# EAGLE design LCD and Button Board (EAGLE 8.2.0)
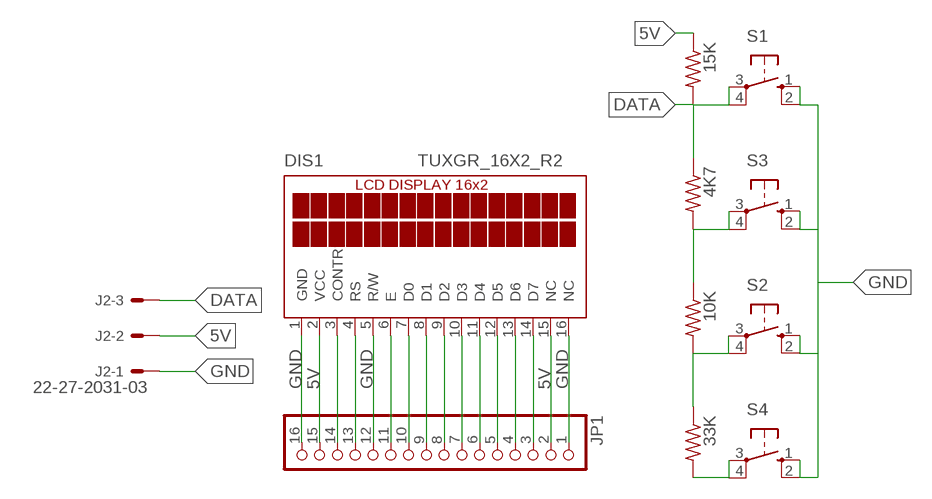
[diagram p0: schematic, sheet 1]

## Parts
4K7  R-US_0207/10  [0207/10]
10K  R-US_0207/10  [0207/10]
15K  R-US_0207/10  [0207/10]
33K  R-US_0207/10  [0207/10]
DIS1  TUXGR_16X2_R2  [TUXGR_16X2_R2]
J2  22-27-2031-03  [6410-03]
JP1  PINHD-1X16  [1X16]
S1  40-XX  [B3F-40XX]
S2  40-XX  [B3F-40XX]
S3  40-XX  [B3F-40XX]
S4  40-XX  [B3F-40XX]

## Nets
5V: 15K.1 DIS1.2(VCC) DIS1.15(NC) J2.2 JP1.2 JP1.15
DATA: 4K7.1 15K.2 J2.3 S1.3(P) S1.4(P1)
GND: DIS1.1(GND) DIS1.5(R/W) DIS1.16(NC) J2.1 JP1.1 JP1.12 JP1.16 S1.1(S) S1.2(S1) S2.1(S) S2.2(S1) S3.1(S) S3.2(S1) S4.1(S) S4.2(S1)
N$3: DIS1.3(CONTR) JP1.14
N$4: DIS1.4(RS) JP1.13
N$6: DIS1.6(E) JP1.11
N$7: DIS1.7(D0) JP1.10
N$8: DIS1.8(D1) JP1.9
N$9: DIS1.9(D2) JP1.8
N$10: DIS1.10(D3) JP1.7
N$11: DIS1.11(D4) JP1.6
N$12: DIS1.12(D5) JP1.5
N$13: DIS1.13(D6) JP1.4
N$14: DIS1.14(D7) JP1.3
N$17: 33K.2 S4.3(P) S4.4(P1)
N$18: 10K.2 33K.1 S2.3(P) S2.4(P1)
N$19: 4K7.2 10K.1 S3.3(P) S3.4(P1)

## Library data of the parts
4K7 10K 15K 33K = adafruit:R-US_: RESISTOR, American symbol
DIS1 = display-lcd:TUXGR_16X2_R2: Tuxgraphics LCD display 16x2 characters reflective, without background light Source: tuxgr_12x2_r2.pdf; OC_FARNELL: unknown; OC_NEWARK: unknown
J2 = con-molex:22-?-03: CONNECTOR wire to board 2.54 mm (.1 inch) pitch header; MF: MOLEX; OC_FARNELL: unknown; OC_NEWARK: unknown
JP1 = pinhead:PINHD-1X16: PIN HEADER
S1-S4 = adafruit:40-XX: OMRON SWITCH; MF: OMRON COMPONENTS USA; MPN: B3F-4000; OC_FARNELL: 176434; OC_NEWARK: 36K3105

## Board
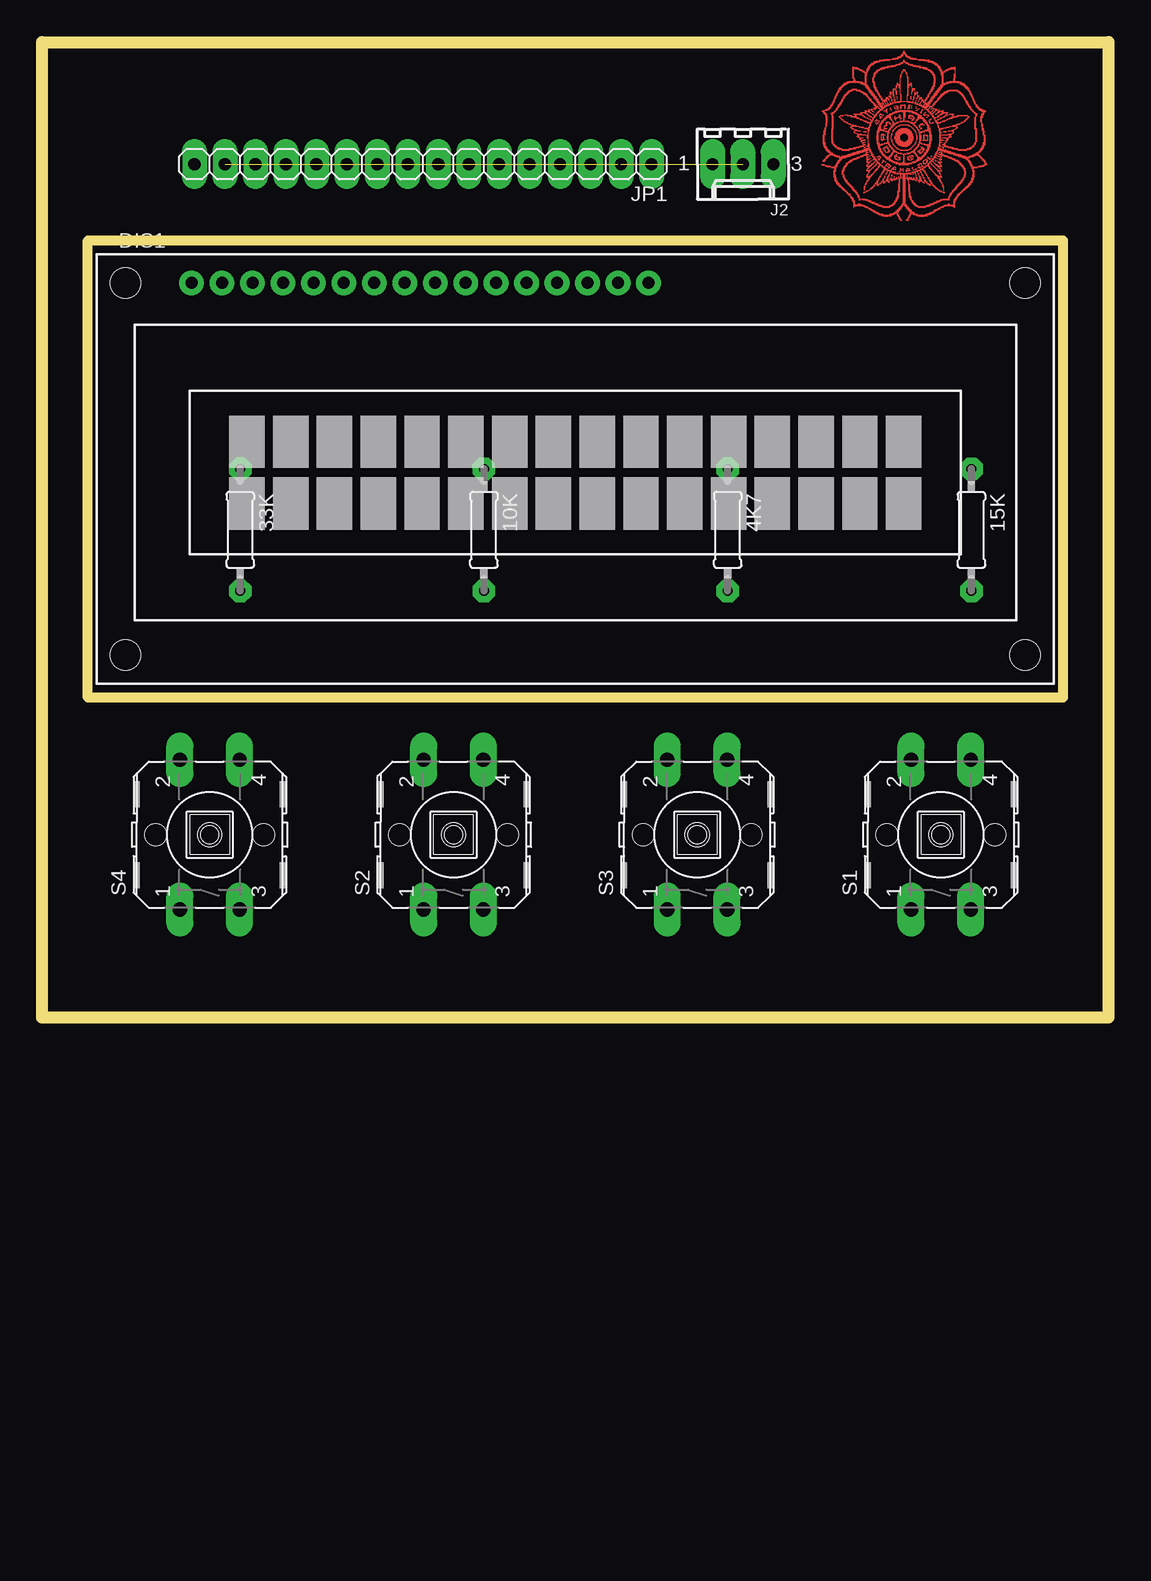
[diagram p1: board, top side]
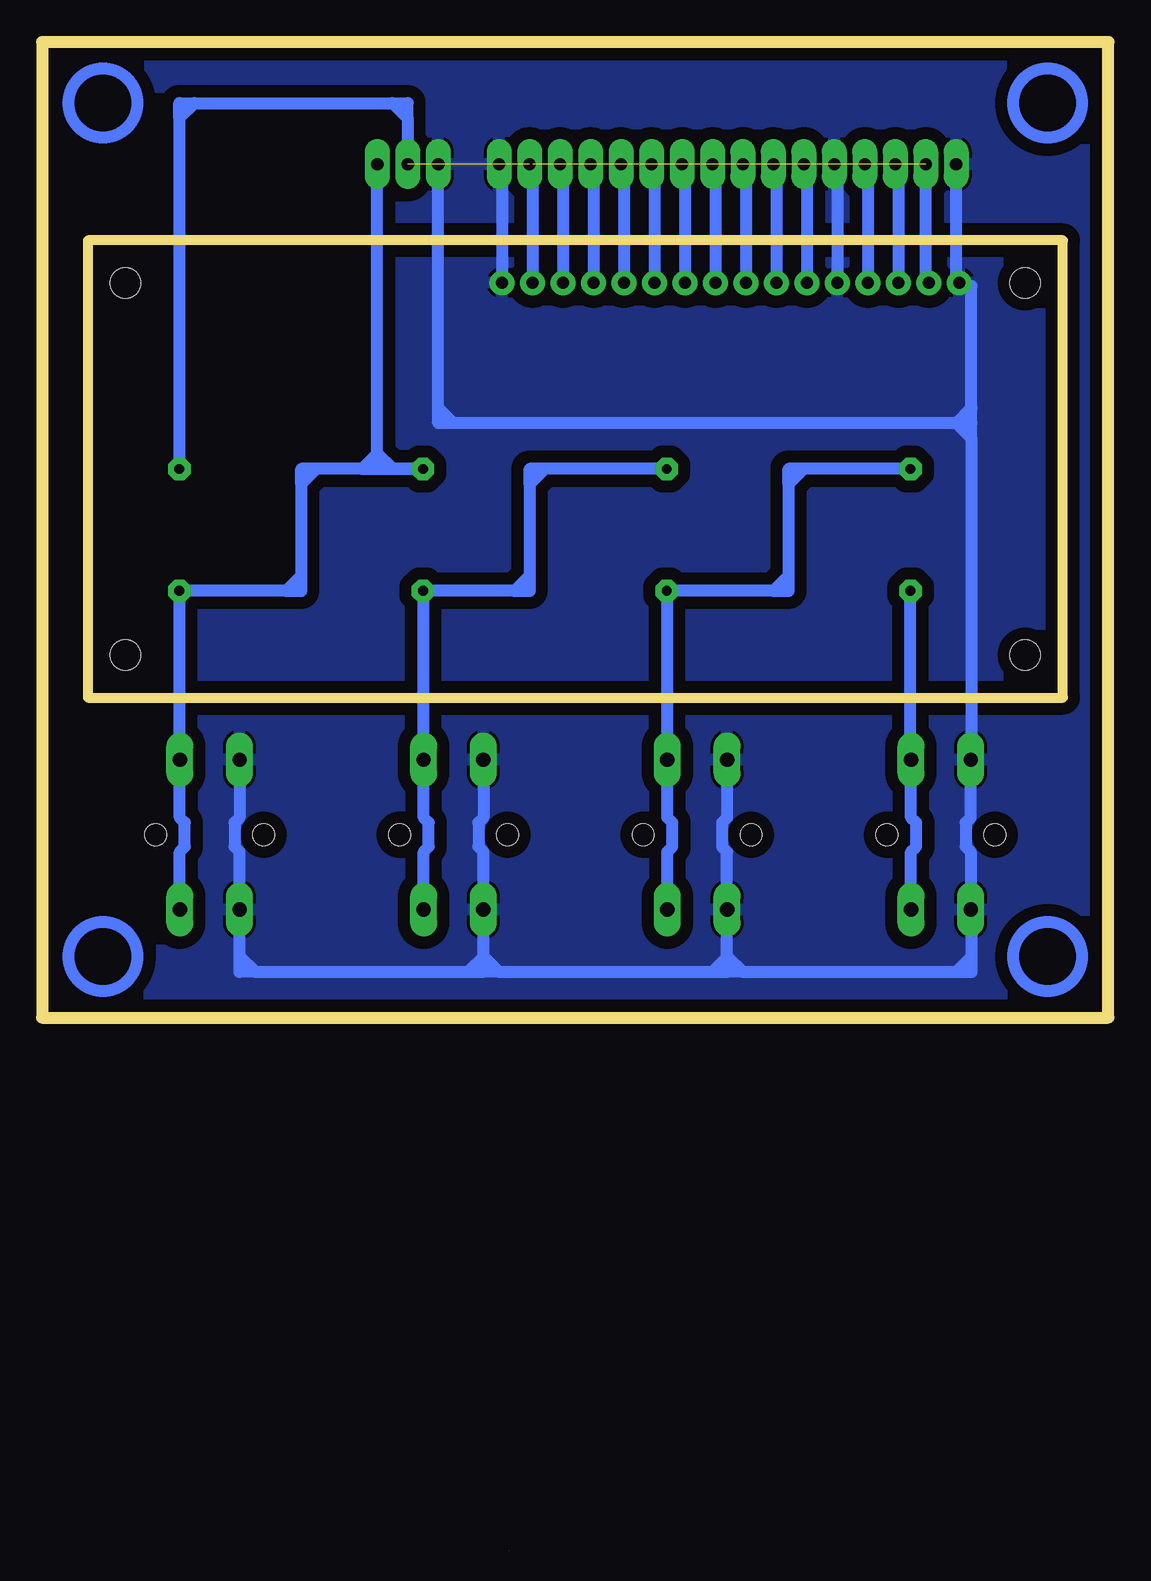
[diagram p2: board, bottom side, seen from below]

Size 88.9 x 125.73 mm. Coordinates in mm from the lower left corner, seen from the top.
Outline: 0,44.45 88.88,44.45 88.88,125.4 0,125.4 0,44.45
Outline: 0,44.45 88.9,44.45 88.9,125.73 0,125.73 0,44.45
Outline: 3.81,109.22 85.09,109.22 85.09,71.12 3.81,71.12 3.81,109.22
Copper layers (1*16): Top 0.035mm / dielectric 1.5mm / Bottom 0.035mm
Design rules "default *": minimum track width 6mil, minimum drill 0.35mm, track to track 6mil, track to pad 6mil, pad to pad 6mil, via to via 6mil, smd to smd 6mil, copper to edge 40mil, drill to drill 6mil, minimum pad ring 21mil, minimum via ring 21mil, stop-mask expansion 4mil, vias tented up to drill 0mil, thermal gap 10mil

### Footprints (pad centres in the part's own frame; a part is rotated, then mirrored left to right if it is on the bottom)
0207/10 = drill 0.813 pad 1.676 octagon: 1 -5.08,0; 2 5.08,0
TUXGR_16X2_R2 = drill 1 pad 1.676: 1 -32,15.5; 2 -29.46,15.5; 3 -26.92,15.5; 4 -24.38,15.5; 5 -21.84,15.5; 6 -19.3,15.5; 7 -16.76,15.5; 8 -14.22,15.5; 9 -11.68,15.5; 10 -9.14,15.5; 11 -6.6,15.5; 12 -4.06,15.5; 13 -1.52,15.5; 14 1.02,15.5; 15 3.56,15.5; 16 6.1,15.5 | hole 2.5: -37.5,-15.5; 37.5,-15.5; -37.5,15.5; 37.5,15.5
6410-03 = drill 1.016 long: 1 2.54,0; 2 0,0; 3 -2.54,0
1X16 = drill 1.016 long: 1 -19.05,0; 2 -16.51,0; 3 -13.97,0; 4 -11.43,0; 5 -8.89,0; 6 -6.35,0; 7 -3.81,0; 8 -1.27,0; 9 1.27,0; 10 3.81,0; 11 6.35,0; 12 8.89,0; 13 11.43,0; 14 13.97,0; 15 16.51,0; 16 19.05,0
B3F-40XX = drill 1.194 long: 1 -6.248,2.489; 2 6.248,2.489; 3 -6.248,-2.489; 4 6.248,-2.489 | hole 1.803: 0,-4.496; 0,4.496

### Placement (x,y rotation side)
4K7  57.15,85.09 270 top
10K  36.83,85.09 270 top
15K  77.47,85.09 270 top
33K  16.51,85.09 270 top
DIS1  44.45,90.17 0 top
J2  58.42,115.57 180 top
JP1  31.75,115.57 180 top
S1  74.93,59.69 90 top
S2  34.29,59.69 90 top
S3  54.61,59.69 90 top
S4  13.97,59.69 90 top

### Tracks (layer width: path | path; a pad name or v marks a point on that pad's centre or on a via)
5V  (2 unrouted)
  Bottom 1.016: 58.42,119.38 58.42,120.65 77.47,120.65 77.47,119.38 | 58.42,119.38 J2.2 | 77.47,119.38 15K.1 | 76.2,120.65 77.47,119.38 | 59.69,120.65 58.42,119.38 | DIS1.2 15.24,105.67 JP1.15 | JP1.2 48.01,115.57 DIS1.15
DATA
  Bottom 1.016: S1.3 77.42,58.27 77,58.69 77,60.69 77.42,61.11 S1.4 77.47,65.94 15K.2 68.58,80.01 | 62.23,90.17 59.69,90.17 | 62.23,90.17 67.31,90.17 67.31,88.9 | 59.69,90.17 4K7.1 59.69,90.17 | 67.31,88.9 67.31,80.01 68.58,80.01 | 59.69,90.17 60.96,90.17 J2.3 | 59.69,90.17 60.96,91.44 62.23,90.17 | 67.31,81.28 68.58,80.01 | 66.04,90.17 67.31,88.9
GND
  Bottom 1.016: S2.2 31.8,61.11 32.22,60.69 32.22,58.69 31.8,58.27 S2.1 31.8,48.26 | S3.2 52.12,61.11 52.54,60.69 52.54,58.69 52.12,58.27 S3.1 52.12,48.26 | S1.2 72.44,61.11 72.86,60.69 72.86,58.69 72.44,58.27 S1.1 72.44,48.26 71.12,48.26 | 12.7,48.26 11.43,48.26 11.43,53.44 S4.1 11.48,58.27 11.9,58.69 11.9,60.69 11.48,61.11 S4.2 11.43,65.94 11.43,92.71 | 30.48,48.26 12.7,48.26 | 30.48,48.26 31.8,48.26 | 33.02,48.26 31.8,48.26 | 50.8,48.26 33.02,48.26 | 50.8,48.26 52.12,48.26 | 53.34,48.26 52.12,48.26 | 71.12,48.26 53.34,48.26 | 11.43,92.71 11.43,93.98 | 12.7,93.98 54.61,93.98 | 12.7,93.98 11.43,93.98 | 54.61,93.98 55.88,93.98 J2.1 | 12.7,93.98 11.43,92.71 | 55.88,95.25 54.61,93.98 | 11.43,49.53 12.7,48.26 | 30.48,48.26 31.75,49.53 31.8,49.53 31.8,49.48 33.02,48.26 | 50.8,48.26 52.07,49.53 52.12,49.53 52.12,49.48 53.34,48.26 | 72.44,49.53 72.39,49.53 71.12,48.26 | JP1.16 12.7,105.67 DIS1.1 12.45,105.41 11.43,105.41 11.43,93.98 | JP1.1 50.55,115.57 DIS1.16 | JP1.12 22.61,115.57 DIS1.5 | 11.43,95.25 12.7,93.98
  pour Bottom (isolate 1.016): -1.27,127 90.17,127 90.17,43.18 -1.27,43.18
N$3
  Bottom 1.016: JP1.14 17.53,115.57 DIS1.3
N$4
  Bottom 1.016: JP1.13 20.07,115.57 DIS1.4
N$6
  Bottom 1.016: JP1.11 25.15,115.57 DIS1.6
N$7
  Bottom 1.016: JP1.10 27.69,115.57 DIS1.7
N$8
  Bottom 1.016: JP1.9 30.23,115.57 DIS1.8
N$9
  Bottom 1.016: JP1.8 32.77,115.57 DIS1.9
N$10
  Bottom 1.016: JP1.7 35.31,115.57 DIS1.10
N$11
  Bottom 1.016: JP1.6 37.85,115.57 DIS1.11
N$12
  Bottom 1.016: JP1.5 40.39,115.57 DIS1.12
N$13
  Bottom 1.016: JP1.4 42.93,115.57 DIS1.13
N$14
  Bottom 1.016: JP1.3 45.47,115.57 DIS1.14
N$17
  Bottom 1.016: 33K.2 16.51,65.94 S4.4 16.46,61.11 16.04,60.69 16.04,58.69 16.46,58.27 S4.3
N$18
  Bottom 1.016: S2.3 36.78,58.27 36.36,58.69 36.36,60.69 36.78,61.11 S2.4 36.83,65.94 10K.2 27.94,80.01 | 26.67,88.9 26.67,90.17 33K.1 | 26.67,88.9 26.67,80.01 27.94,80.01 | 25.4,90.17 26.67,88.9 | 26.67,81.28 27.94,80.01
N$19
  Bottom 1.016: S3.3 57.1,58.27 56.68,58.69 56.68,60.69 57.1,61.11 S3.4 57.15,65.94 4K7.2 49.53,80.01 | 10K.1 48.26,90.17 48.26,88.9 | 49.53,80.01 48.26,80.01 48.26,88.9 | 46.99,90.17 48.26,88.9 | 48.26,81.28 49.53,80.01
N$20
  Bottom 1.016: 0,125.73 88.9,125.73 88.9,44.45 0,44.45 0,125.73
(copper drawn outside any net)
  shapes: Bottom circle x4, Top area x2848

### Text on the board
cooling: WIDIPA_UGM | UP | DOWN | OK | BACK